# Altium project SMAQ-Board_Design.PrjPcb (part 3 of 3)

## Sheet [6] - A2 Full Schematic.SchDoc: SMAQ Board Full Schematic
size A2; ApprovedBy: Team 7; CheckedBy: Charitonidis A.; Author: Charitonidis Alexandros; CompanyName: SMAQ; DrawnBy: Charitonidis A.; Engineer: Charitonidis Alexandros; DocumentNumber: SCH-A2; Revision: 1.1; SheetNumber: 6; SheetTotal: 6; =documentnumber: 1
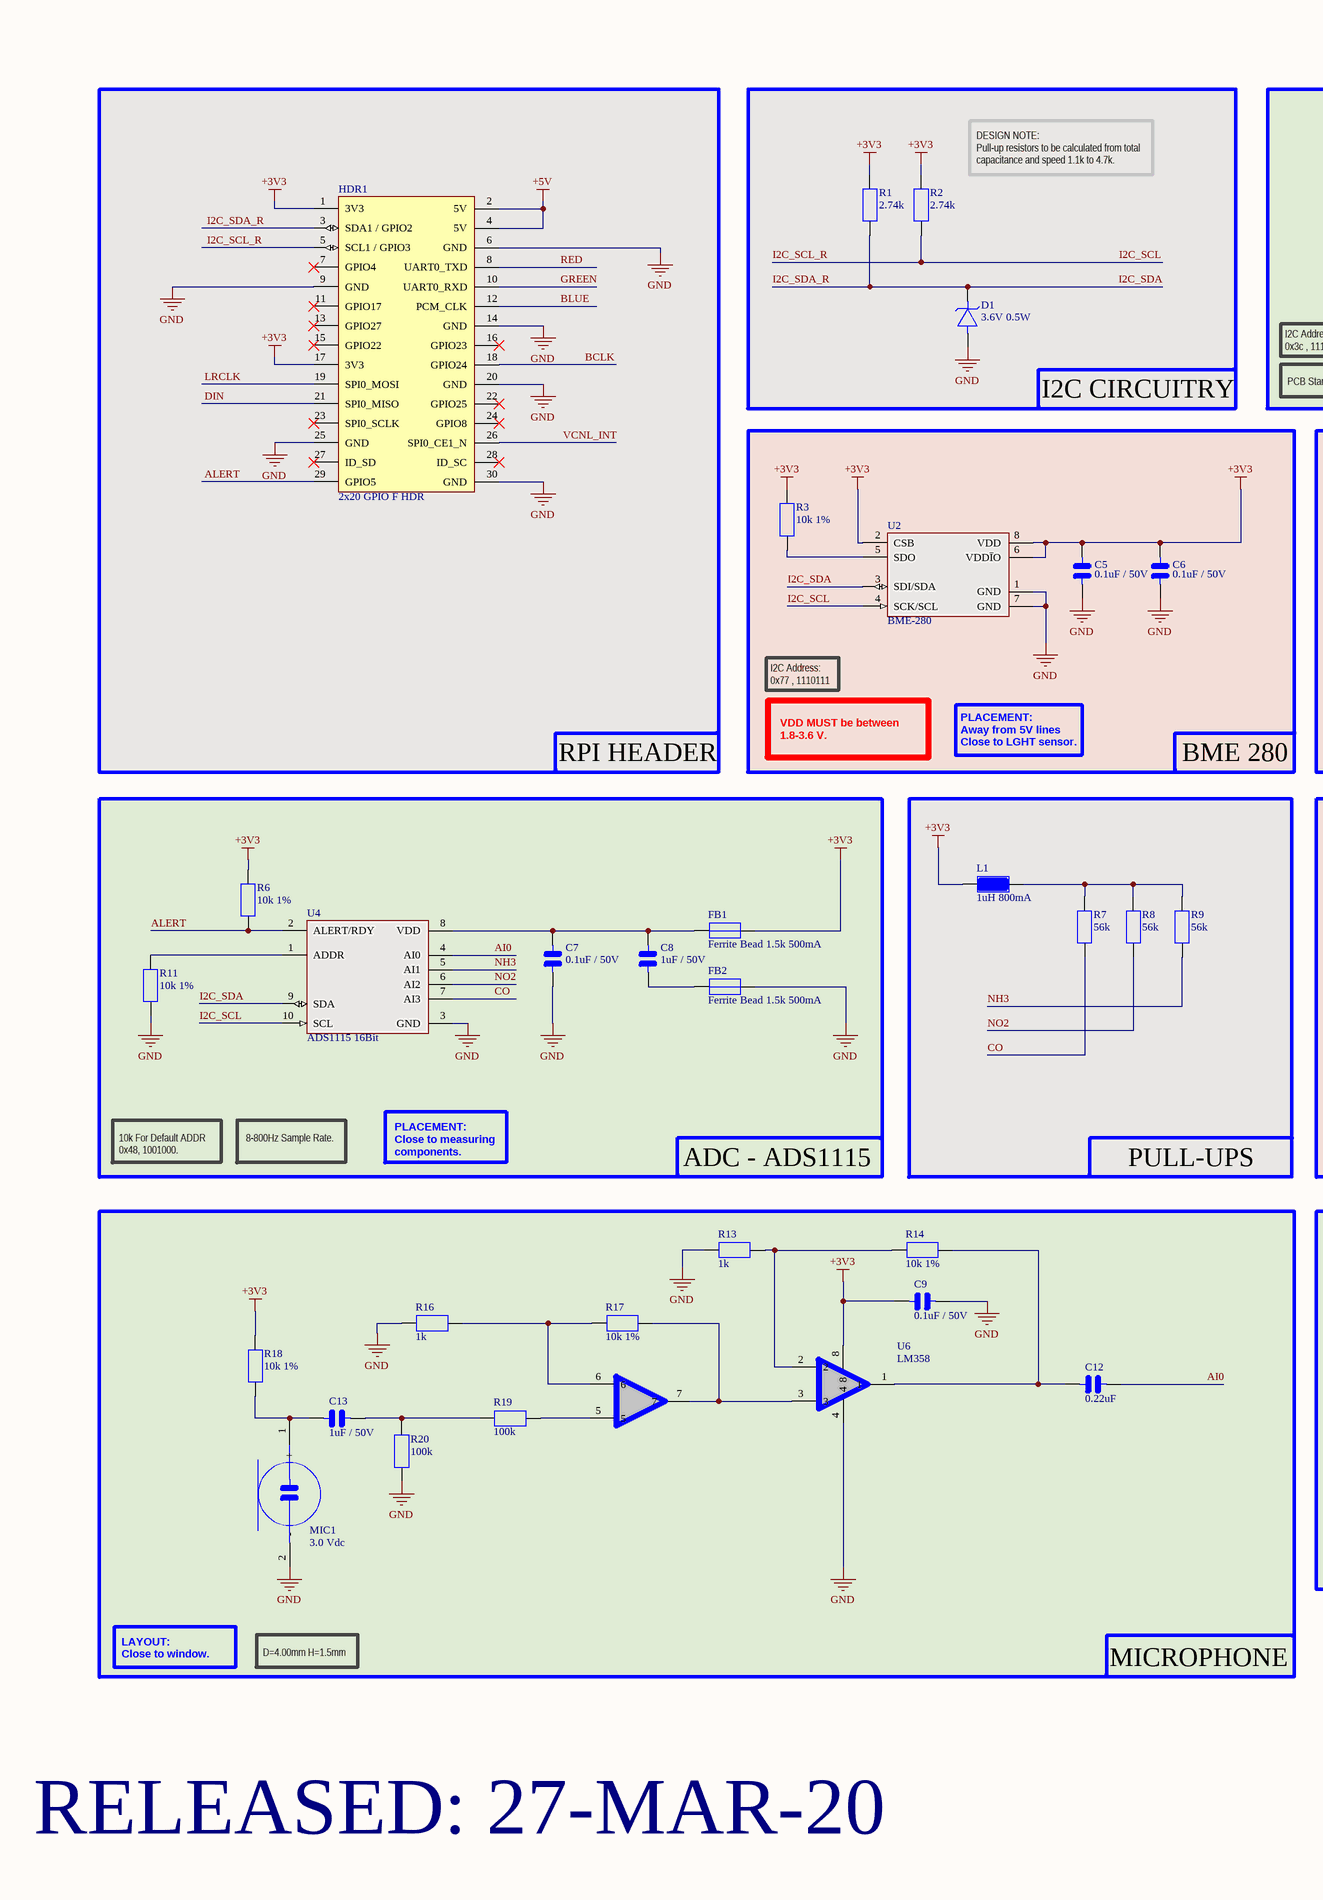
[diagram p5: [6] - A2 Full Schematic.SchDoc, left]
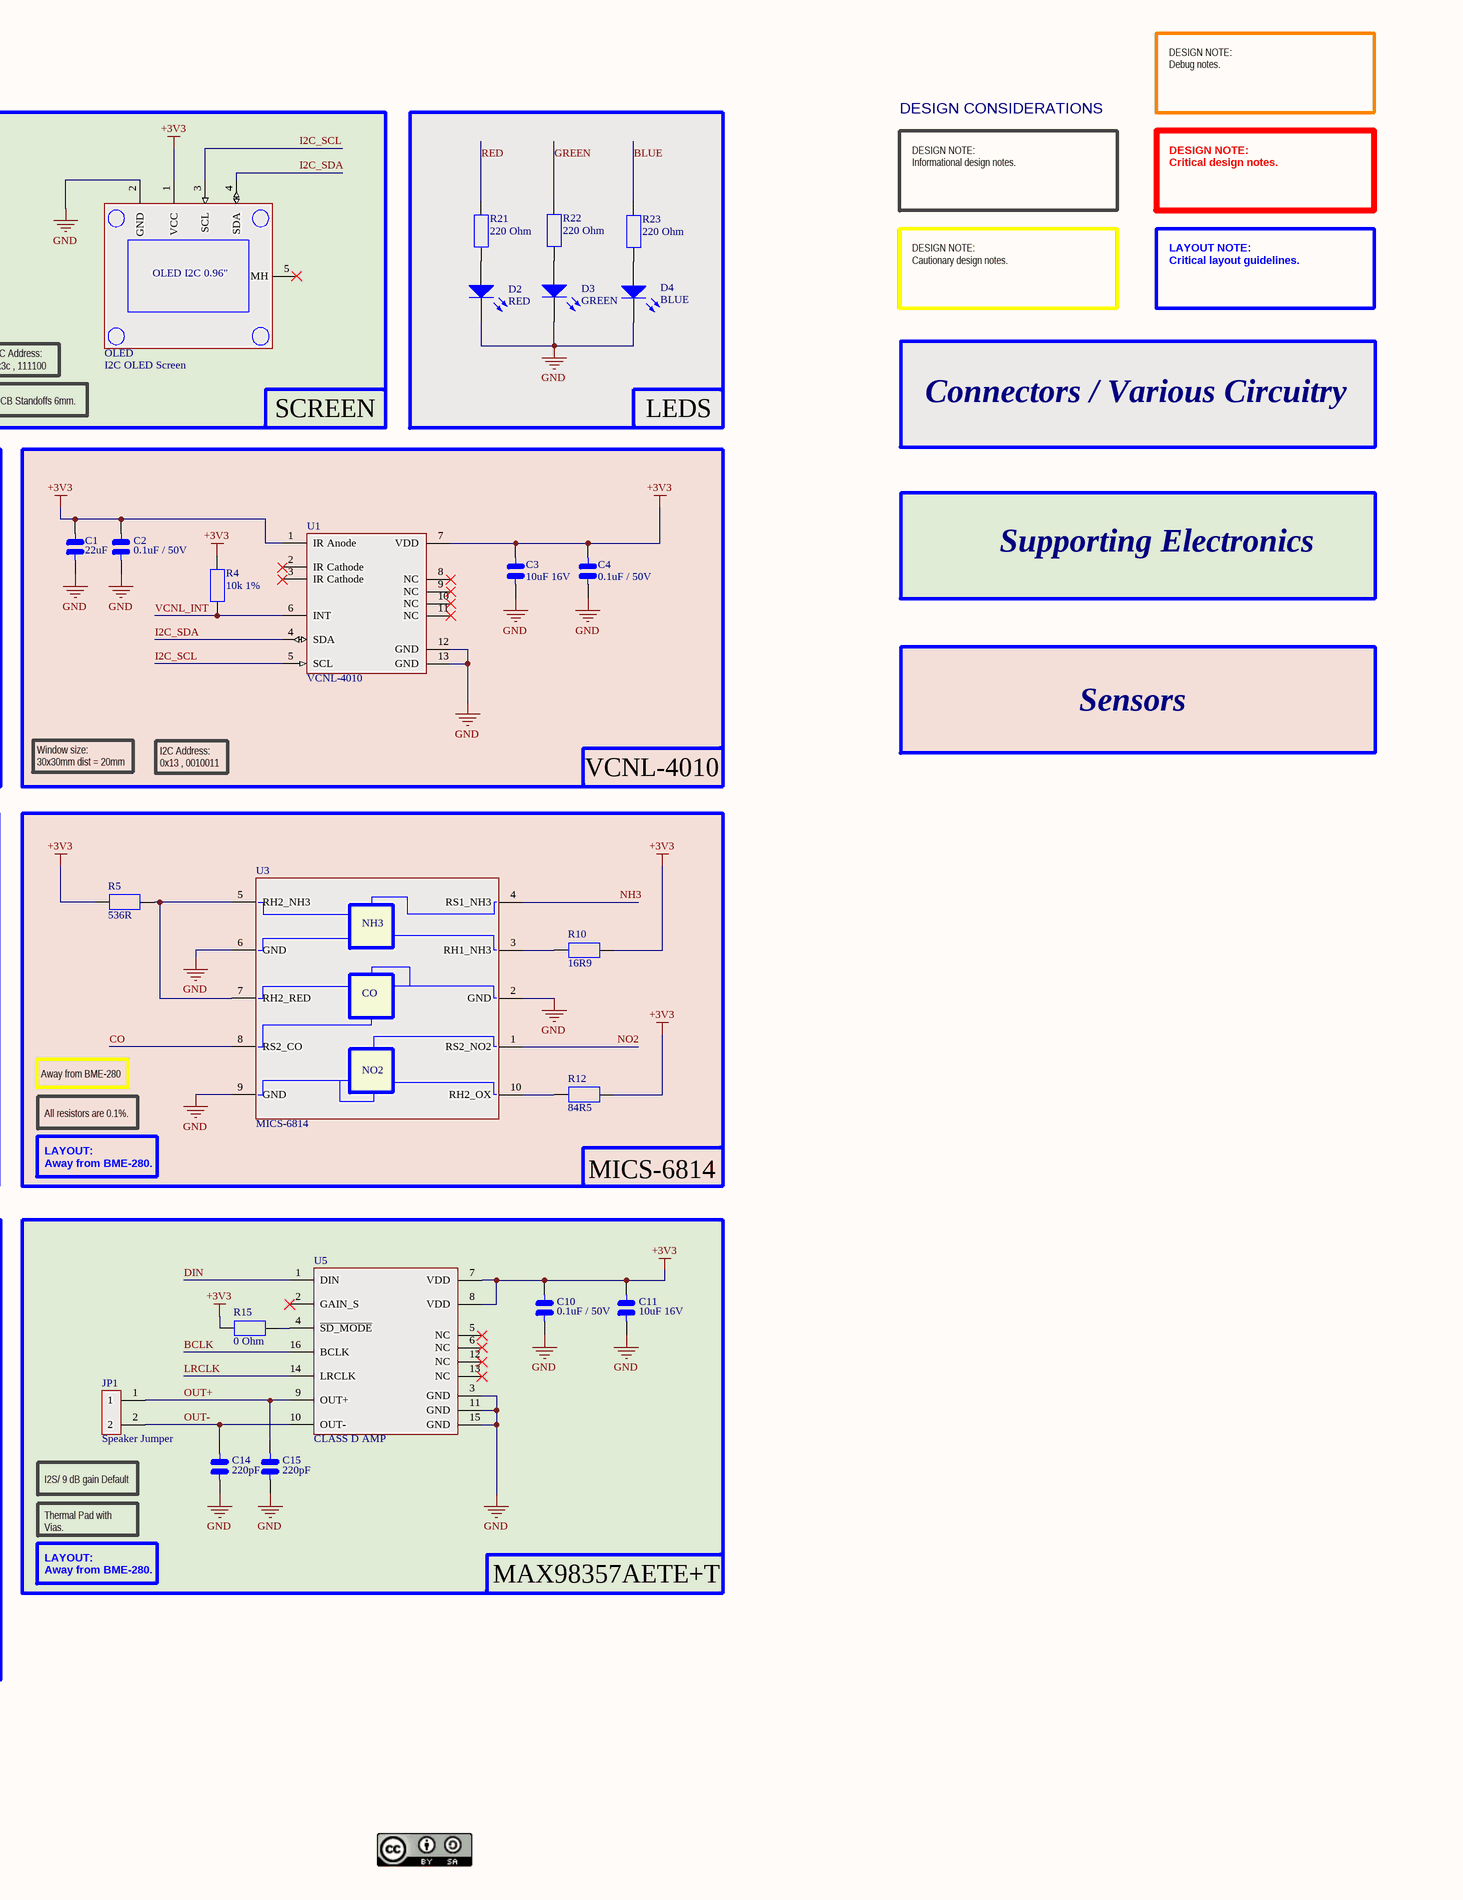
[diagram p6: [6] - A2 Full Schematic.SchDoc, right]

### Parts
(Parts that share a designator on the sheet are numbered #1, #2 ... from top to bottom, then left to right.)
C1#2  22uF  [C0805]
C2#2  0.1uF / 50V  [C0805]
C3#2  10uF 16V  [C0805]
C4#2  0.1uF / 50V  [C0805]
C5#2  0.1uF / 50V  [C0805]
C6#2  0.1uF / 50V  [C0805]
C7#2  0.1uF / 50V  [C0805]
C8#2  1uF / 50V  [C0805]
C9#2  0.1uF / 50V  [C0805]
C10#2  0.1uF / 50V  [C0805]
C11#2  10uF 16V  [C0805]
C12#2  0.22uF  [C0805]
C13#2  1uF / 50V  [C0805]
C14#2  220pF  [C0805]
C15#2  220pF  [C0805]
D1#2  3.6V 0.5W  [SOD-123]
D2#2  RED  [LED-1]
D3#2  GREEN  [LED-1]
D4#2  BLUE  [LED-1]
FB1#2  Ferrite Bead 1.5k 500mA  [C0805]
FB2#2  Ferrite Bead 1.5k 500mA  [C0805]
HDR1  2x20 GPIO F HDR  [2x20_Pi_Header]
JP1#2  Speaker Jumper  [Speaker Jumper]
L1#2  1uH 800mA  [C0805]
MIC1#2  3.0 Vdc  [Speaker Jumper]
OLED#2  I2C OLED Screen  [OLED_I2C_0.96"]  (no BOM)
R1#2  2.74k  [R0805 (2012M)]
R2#2  2.74k  [R0805 (2012M)]
R3#2  10k 1%  [R0805 (2012M)]
R4#2  10k 1%  [R0805 (2012M)]
R5#2  536R  [R0805 (2012M)]
R6#2  10k 1%  [R0805 (2012M)]
R7#2  56k  [R0805 (2012M)]
R8#2  56k  [R0805 (2012M)]
R9#2  56k  [R0805 (2012M)]
R10#2  16R9  [R0805 (2012M)]
R11#2  10k 1%  [R0805 (2012M)]
R12#2  84R5  [R0805 (2012M)]
R13#2  1k  [R0805 (2012M)]
R14#2  10k 1%  [R0805 (2012M)]
R15#2  0 Ohm  [R0805 (2012M)]
R16#2  1k  [R0805 (2012M)]
R17#2  10k 1%  [R0805 (2012M)]
R18#2  10k 1%  [R0805 (2012M)]
R19#2  100k  [R0805 (2012M)]
R20#2  100k  [R0805 (2012M)]
R21#2  220 Ohm  [R0805 (2012M)]
R22#2  220 Ohm  [R0805 (2012M)]
R23#2  220 Ohm  [R0805 (2012M)]
U1#2  VCNL-4010  [VCNL-4010]
U2#2  BME-280  [LGA_8P_0.65MM]
U3#2  MICS-6814  [MICS-10]
U4#2  ADS1115 16Bit  [VSSOP-10]
U5  CLASS D AMP  [16LTHINQFN]
U6#2  LM358  [SOIC-8]

### Blocks framed on the sheet
RPI HEADER: HDR1
I2C CIRCUITRY: D1#2 R1#2 R2#2
SCREEN: OLED#2
LEDS: D2#2 D3#2 D4#2 R21#2 R22#2 R23#2
BME 280: C5#2 C6#2 R3#2 U2#2
VCNL-4010: C1#2 C2#2 C3#2 C4#2 R4#2 U1#2
ADC - ADS1115: C7#2 C8#2 FB1#2 FB2#2 R6#2 R11#2 U4#2
PULL-UPS: L1#2 R7#2 R8#2 R9#2
MICS-6814: R5#2 R10#2 R12#2 U3#2
MICROPHONE: C9#2 C12#2 C13#2 MIC1#2 R13#2 R14#2 R16#2 R17#2 R18#2 R19#2 R20#2 U6#2
MAX98357AETE+T: C10#2 C11#2 C14#2 C15#2 JP1#2 R15#2 U5

### Nets
+3V3: C1#2.2 C2#2.2 C3#2.2 C4#2.1 C5#2.2 C6#2.2 C9#2.1 C10#2.2 C11#2.2 FB1#2.2 HDR1.1(3V3) HDR1.17(3V3) L1#2.1 OLED#2.1(VCC) R1#2.2 R2#2.2 R3#2.2 R4#2.2 R5#2.1 R6#2.2 R10#2.2 R12#2.2 R15#2.2 R18#2.2 U1#2.1(IR_Anode) U1#2.7(VDD) U2#2.2(CSB) U2#2.6(VDD~{I}O) U2#2.8(VDD) U5.7(VDD) U5.8(VDD) U6#2.8
+5V: HDR1.2(5V) HDR1.4(5V)
GND: C1#2.1 C2#2.1 C3#2.1 C4#2.2 C5#2.1 C6#2.1 C7#2.1 C9#2.2 C10#2.1 C11#2.1 C14#2.1 C15#2.1 D1#2.1 D2#2.2(K) D3#2.2(K) D4#2.2(K) FB2#2.2 HDR1.6(GND) HDR1.9(GND) HDR1.14(GND) HDR1.20(GND) HDR1.25(GND) HDR1.30(GND) MIC1#2.2(-) OLED#2.2(GND) R11#2.1 R13#2.1 R16#2.1 R20#2.1 U1#2.12(GND) U1#2.13(GND) U2#2.1(GND) U2#2.7(GND) U3#2.2(GND) U3#2.6(GND) U3#2.9(GND) U4#2.3(GND) U5.3(GND) U5.11(GND) U5.15(GND) U6#2.4
AI0: C12#2.2 U4#2.4(AI0)
ALERT: HDR1.29(GPIO5) R6#2.1 U4#2.2(ALERT/RDY)
BCLK: HDR1.18(GPIO24) U5.16(BCLK)
BLUE: HDR1.12(PCM_CLK) R23#2.2
CO: R7#2.1 U3#2.8(RS2_CO) U4#2.7(AI3)
DIN: HDR1.21(SPI0_MISO) U5.1(DIN)
GREEN: HDR1.10(UART0_RXD) R22#2.2
I2C_SCL: HDR1.5(SCL1_/_GPIO3) OLED#2.3(SCL) R2#2.1 U1#2.5(SCL) U2#2.4(SCK/SCL) U4#2.10(SCL)  [also labelled I2C_SCL_R]
I2C_SDA: D1#2.2 HDR1.3(SDA1_/_GPIO2) OLED#2.4(SDA) R1#2.1 U1#2.4(SDA) U2#2.3(SDI/SDA) U4#2.9(SDA)  [also labelled I2C_SDA_R]
LRCLK: HDR1.19(SPI0_MOSI) U5.14(LRCLK)
NH3: R9#2.1 U3#2.4(RS1_NH3) U4#2.5(AI1)
NO2: R8#2.1 U3#2.1(RS2_NO2) U4#2.6(AI2)
OUT+: C15#2.2 JP1#2.1 U5.9(OUT+)
OUT-: C14#2.2 JP1#2.2 U5.10(OUT-)
RED: HDR1.8(UART0_TXD) R21#2.2
VCNL_INT: HDR1.26(SPI0_CE1_N) R4#2.1 U1#2.6(INT)
NetC7#2_2: C7#2.2 C8#2.2 FB1#2.1 U4#2.8(VDD)
NetC8#2_1: C8#2.1 FB2#2.1
NetC12#2_1: C12#2.1 R14#2.2 U6#2.1
NetC13#2_1: C13#2.1 MIC1#2.1(+) R18#2.1
NetC13#2_2: C13#2.2 R19#2.2 R20#2.2
NetD2#2_1: D2#2.1(A) R21#2.1
NetD3#2_1: D3#2.1(A) R22#2.1
NetD4#2_1: D4#2.1(A) R23#2.1
NetL1#2_2: L1#2.2 R7#2.2 R8#2.2 R9#2.2
NetR3#2_1: R3#2.1 U2#2.5(SDO)
NetR5#2_2: R5#2.2 U3#2.5(RH2_NH3) U3#2.7(RH2_RED)
NetR10#2_1: R10#2.1 U3#2.3(RH1_NH3)
NetR11#2_2: R11#2.2 U4#2.1(ADDR)
NetR12#2_1: R12#2.1 U3#2.10(RH2_OX)
NetR13#2_2: R13#2.2 R14#2.1 U6#2.2
NetR15#2_1: R15#2.1 U5.4(~{SD_MODE})
NetR16#2_2: R16#2.2 R17#2.2 U6#2.6
NetR17#2_1: R17#2.1 U6#2.3 U6#2.7
NetR19#2_1: R19#2.1 U6#2.5

Not connected (* = marked no-connect by the designer): HDR1 7(GPIO4)* 11(GPIO17)* 13(GPIO27)* 15(GPIO22)* 16(GPIO23)* 22(GPIO25)* 23(SPI0_SCLK)* 24(GPIO8)* 27(ID_SD)* 28(ID_SC)*; OLED#2 5(MH)*; U1#2 2(IR_Cathode)* 3(IR_Cathode)* 8(NC)* 9(NC)* 10(NC)* 11(NC)*; U5 2(GAIN_S)* 5(NC)* 6(NC)* 12(NC)* 13(NC)*

### Notes on the sheet
- DESIGN CONSIDERATIONS
- DESIGN NOTE:
  Debug notes.
- DESIGN NOTE:
  Pull-up resistors to be calculated from total capacitance and speed 1.1k to 4.7k.
- DESIGN NOTE:
  Informational design notes.
- DESIGN NOTE:
  Critical design notes.
- DESIGN NOTE:
  Cautionary design notes.
- LAYOUT NOTE:
  Critical layout guidelines.
- I2C Address: 0x3c , 111100
- PCB Standoffs 6mm.
- Connectors / Various Circuitry
- Supporting Electronics
- I2C Address: 0x77 , 1110111
- VDD MUST be between 1.8-3.6 V.
- PLACEMENT:
  Away from 5V lines
  Close to LGHT sensor.
- Window size: 30x30mm dist = 20mm
- I2C Address: 0x13 , 0010011
- Sensors
- Away from BME-280
- All resistors are 0.1%.
- 10k For Default ADDR
  0x48, 1001000.
- 8-800Hz Sample Rate.
- PLACEMENT:
  Close to measuring components.
- LAYOUT:
  Away from BME-280.
- (near JP1#2) I2S/ 9 dB gain Default
- Thermal Pad with Vias.
- LAYOUT:
  Close to window.
- D=4.00mm H=1.5mm
- RELEASED: 27-MAR-20
- Title
- Drawn By:
- Checked By:
- Size:
- Date:
- A2
- Number:
- Time:
- Revision:
- Sheet
- of
- Approved By:
- Team Number:
- This work is licensed under the Creative Commons Attribution-ShareAlike 3.0 Unported License. To view a copy of this license, visit http://creativecommons.org/licenses/by-sa/3.0/ or send a letter to Creative Commons, PO Box 1866, Mountain View, CA 94042, USA.
- (in symbol MICS-6814) NH3; CO; NO2
- (in symbol OLED_I2C_BREAKOUT) OLED I2C 0.96"

### Library data of the parts
C1#2 = C2012JB1A226M085AC: CAP CER 22UF 10V JB 0805; Manufacturer 1: TDK; Category 1: Ceramic Capacitors; Dielectric Material: Ceramic; Tolerance: 20%; Supplier 1: Mouser; Manufacturer Part Number 1: C2012JB1A226M085AC; RoHS: Yes; Description 1: CAP CER 22UF 10V JB 0805; Stock 1: 10381; Mount: Surface Mount; Case/Package: 0805; Case Code (Metric): 2012; Case Code (Imperial): 0805; Min Operating Temperature: -25°C; Max Operating Temperature: 85°C; Package Quantity: 1; Packaging: Tape and Reel; Capacitance: 22uF; Voltage Rating: 10V; Termination: SMD/SMT; Composition: Ceramic; Voltage Rating (DC): 10V; Length: 0.079inch; Height: 0.85mm; Width: 1.2mm; Thickness: 0.039inch; Lead Free: Lead Free; ComponentLink1URL: https://datasheet.ciiva.com/14908/tdkmlcccaprange-14908199.pdf?src-supplier=Digi-Key; ComponentLink1Description: https://datasheet.ciiva.com/14908/tdkmlcccaprange-14908199.pdf?src-supplier=Digi-Key; ComponentLink2URL: https://datasheet.ciiva.com/14908/tdkmlcccaprange-14908201.pdf?src-supplier=Digi-Key; ComponentLink2Description: https://datasheet.ciiva.com/14908/tdkmlcccaprange-14908201.pdf?src-supplier=Digi-Key; Supplier Part Number 1: 810-C2012JB1A226M08C
C2#2 C4#2 C5#2 C6#2 C7#2 C9#2 C10#2 = 08055C104JAT4A: CAP CER 0.1UF 50V X7R 0805; Manufacturer 1: Kyocera AVX; Category 1: Ceramic Capacitors; Capacitance: 100nF; Tolerance: 5%; Supplier 1: Mouser; Manufacturer Part Number 1: 08055C104JAT4A; RoHS: Yes; Description 1: CAP CER 0.1UF 50V X7R 0805; Stock 1: 70357; Mount: Surface Mount; Case/Package: 0805; Number of Pins: 2; Case Code (Imperial): 0805; Case Code (Metric): 2012; Min Operating Temperature: -55°C; Max Operating Temperature: 125°C; Dielectric: X7R; Package Quantity: 10000; Voltage Rating: 50V; Packaging: Tape and Reel; Termination: SMD/SMT; Voltage Rating (DC): 50V; Length: 2.01mm; Depth: 1.25mm; Width: 0.049inch; Thickness: 0.037inch; Radiation Hardening: No; Lead Free: Lead Free; ComponentLink1URL: https://datasheet.ciiva.com/16326/cx7r-16326437.pdf?src-supplier=Future+Electronics; ComponentLink1Description: https://datasheet.ciiva.com/16326/cx7r-16326437.pdf?src-supplier=Future+Electronics; ComponentLink2URL: https://datasheet.ciiva.com/6277/cx7r-6277722.pdf?src-supplier=Digi-Key; ComponentLink2Description: https://datasheet.ciiva.com/6277/cx7r-6277722.pdf?src-supplier=Digi-Key; Supplier Part Number 1: 581-08055C104JAT4A
C3#2 C11#2 = 0805YC106MAT2A: Manufacturer 1: Kyocera AVX; Supplier 1: Mouser; Manufacturer Part Number 1: 0805YC106MAT2A; RoHS: No; Stock 1: 1756; Supplier Part Number 1: 581-0805YC106MAT2A
C8#2 C13#2 = 08055C105JAT2A: Manufacturer 1: Kyocera AVX; Category 1: Capacitors; Dielectric: X7R; Tolerance: 5%; Supplier 1: Mouser; Manufacturer Part Number 1: 08055C105JAT2A; RoHS: No; Stock 1: 5621; Voltage: 50V; Supplier Part Number 1: 581-08055C105JAT2A
C12#2 = 08053C224J4Z2A: Multilayer Ceramic Capacitors MLCC - SMD/SMT 25V 0.22uF X7R 0805 5% AEC-Q200; Manufacturer 1: Kyocera AVX; Supplier 1: Mouser; Manufacturer Part Number 1: 08053C224J4Z2A; RoHS: No; Stock 1: 37375; Supplier Part Number 1: 581-08053C224J4Z2A
C14#2 C15#2 = 08055A221F4T2A: T&R / COMMERCIAL CHIP; Manufacturer 1: Kyocera AVX; Category 1: Ceramic Capacitors; Dielectric: C0G; Voltage Rating (DC): 50V; Tolerance: 1%; Supplier 1: Mouser; Manufacturer Part Number 1: 08055A221F4T2A; RoHS: No; Description 1: T&R / COMMERCIAL CHIP; Stock 1: 6955; Case/Package: 0805; Capacitance: 220pF; Supplier Part Number 1: 581-08055A221F4T2A
D1#2 = BZT52B3V6-E3-08: Diode Zener Single 3.6V 2% 500mW 2-Pin SOD-123 T/R; Manufacturer 1: Vishay; Category 1: Zener Diodes; Max Power Dissipation: 410mW; Impedance: 80R; Zener Current: 100mA; Max Reverse Leakage Current: 100nA; Supplier 1: Mouser; Manufacturer Part Number 1: BZT52B3V6-E3-08; RoHS: Yes; Description 1: Diode Zener Single 3.6V 2% 500mW 2-Pin SOD-123 T/R; Stock 1: 29413; Mount: Surface Mount; Case/Package: SOD-123-2; Number of Pins: 2; Weight: 0.000363oz; Min Operating Temperature: -55°C; Max Operating Temperature: 150°C; Packaging: Tape and Reel; Package Quantity: 3000; Zener Voltage: 3.6V; Voltage Tolerance: 2%; Power Dissipation: 500mW; Element Configuration: Single; Tolerance: 2%; ComponentLink1URL: https://datasheet.ciiva.com/24095/bzt52-106265-24095710.pdf?src-supplier=Mouser; ComponentLink1Description: https://datasheet.ciiva.com/24095/bzt52-106265-24095710.pdf?src-supplier=Mouser; Supplier Part Number 1: 78-BZT52B3V6-E3-08
D2#2 D3#2 D4#2 = LED1: Typical RED GaAs LED; Published: 8-Jun-2000; LatestRevisionDate: 08-Jul-2005; LatestRevisionNote: Mech Layer 1 removed.; PackageReference: LED-1; Publisher: Altium Limited; PackageDescription: LED; 2 Leads
FB1#2 FB2#2 = MMZ2012Y152B: Ferrite Beads Multi-Layer 1.5KOhm 25% 100MHz 500mA 400mOhm DCR 0805; Manufacturer 1: TDK; Category 1: Inductors; Impedance: 1.5kR; DC Resistance (DCR): 400mR; Shielding: Unshielded; Supplier 1: Farnell; Manufacturer Part Number 1: MMZ2012Y152B; RoHS: Yes; Description 1: Ferrite Beads Multi-Layer 1.5KOhm 25% 100MHz 500mA 400mOhm DCR 0805; Pricing 1: 10=0.05740, 100=0.03680, 500=0.02670, 1000=0.02100, 2000=0.01900, 4000=0.01700, 20000=0.01600 (GBP); Case/Package: 0805; Number of Pins: 2; Case Code (Metric): 2012; Case Code (Imperial): 0805; Core Material: Ferrite; Material: Ferrite; Min Operating Temperature: -55°C; Max Operating Temperature: 125°C; Tolerance: 25%; Packaging: Tape and Reel; Package Quantity: 4000; Max DC Current: 500mA; Termination: SMD/SMT; Current Rating: 500mA; Test Frequency: 100MHz; DC Current: 500mA; Military Standard: Not; Frequency: 100MHz; Length: 2mm; Height: 0.85mm; Width: 1.25mm; Depth: 1.25mm; Radiation Hardening: No; REACH SVHC: No SVHC; Lead Free: Lead Free; ComponentLink1URL: https://datasheet.ciiva.com/11800/0900766b8082f891-11800917.pdf?src-supplier=RSComponents; ComponentLink1Description: https://datasheet.ciiva.com/11800/0900766b8082f891-11800917.pdf?src-supplier=RSComponents; ComponentLink2URL: https://datasheet.ciiva.com/34302/1868995-34302918.pdf?src-supplier=Jameco; ComponentLink2Description: https://datasheet.ciiva.com/34302/1868995-34302918.pdf?src-supplier=Jameco; ComponentLink3URL: https://datasheet.ciiva.com/15160/getdatasheetpartid-77343-15160260.pdf?src-supplier=Verical; ComponentLink3Description: https://datasheet.ciiva.com/15160/getdatasheetpartid-77343-15160260.pdf?src-supplier=Verical; ComponentLink4URL: https://datasheet.ciiva.com/16001/e9412-mmz2012-16001336.pdf?src-supplier=Onlinecomponents.com; ComponentLink4Description: https://datasheet.ciiva.com/16001/e9412-mmz2012-16001336.pdf?src-supplier=Onlinecomponents.com; Supplier Part Number 1: 1301674
HDR1 = 2X20 Female Header: GPIO FEMALE HEADER RASPBERRY PI; Manufacturer 1: Adafruit Industries; Manufacturer Part Number 1: 2222; Supplier 1: Mouser; RoHS: No; Description 1: GPIO FEMALE HEADER RASPBERRY PI; Stock 1: 1767; ComponentLink1URL: https://cdn-shop.adafruit.com/product-files/2222/00587.pdf?src-supplier=Digi-Key; ComponentLink1Description: https://cdn-shop.adafruit.com/product-files/2222/00587.pdf?src-supplier=Digi-Key; Supplier Part Number 1: 485-2222
L1#2 = KLZ2012MHR1R0HTD25: FIXED IND 1UH 800MA 130 MOHM SMD; Manufacturer 1: TDK; Supplier 1: Mouser; Manufacturer Part Number 1: KLZ2012MHR1R0HTD25; RoHS: No; Description 1: FIXED IND 1UH 800MA 130 MOHM SMD; Stock 1: 3633; ComponentLink1URL: https://product.tdk.com/info/en/catalog/datasheets/inductor_automotive_decoupling_klz2012-hr_en.pdf?src-supplier=Digi-Key; ComponentLink1Description: https://product.tdk.com/info/en/catalog/datasheets/inductor_automotive_decoupling_klz2012-hr_en.pdf?src-supplier=Digi-Key; Supplier Part Number 1: 810-KLZ2012MHR1R0HTD
MIC1#2 = CMC-4015-25L100: 4.0 mm, Omnidirectional, Wire Leads, 3.0 Vdc, IP65 Rated, Electret Condenser Microphone; Manufacturer 1: CUI Devices; Supplier 1: Mouser; Manufacturer Part Number 1: CMC-4015-25L100; Description 1: 4.0 mm, Omnidirectional, Wire Leads, 3.0 Vdc, IP65 Rated, Electret Condenser Microphone; Stock 1: 486; ComponentLink1URL: http://datasheet.octopart.com/CMC-4015-25L100-CUI-Devices-datasheet-137937391.pdf?src-supplier=CUI+Devices; ComponentLink1Description: http://datasheet.octopart.com/CMC-4015-25L100-CUI-Devices-datasheet-137937391.pdf?src-supplier=CUI+Devices; Supplier Part Number 1: 490-CMC-4015-25L100
OLED#2 = OLED_I2C_BREAKOUT
R1#2 R2#2 = ERA-6AEB2741V: Surface Mount Chip Resistor, Thin Film, AEC-Q200 ERA Series, 2.74 kohm, 125 mW, 0.1%, 100 V; Manufacturer 1: Panasonic; Category 1: Chip SMD Resistors; Resistance: 2.74kR; Temperature Coefficient: 25ppm/°C; Power Rating: 125mW; Voltage Rating: 100V; Supplier 1: Farnell; Manufacturer Part Number 1: ERA-6AEB2741V; RoHS: Yes; Description 1: Surface Mount Chip Resistor, Thin Film, AEC-Q200 ERA Series, 2.74 kohm, 125 mW, 0.1%, 100 V; Stock 1: 20000; Pricing 1: 5000=0.02100 (GBP); Mount: Surface Mount; Case/Package: 0805; Number of Pins: 2; Contact Plating: Tin; Case Code (Imperial): 0805; Case Code (Metric): 2012; Min Operating Temperature: -55°C; Max Operating Temperature: 155°C; Tolerance: 0.1%; Composition: Metal Film,Thin Film; Packaging: Tape and Reel; Package Quantity: 1; Number of Terminations: 2; Military Standard: Not; Termination: Solder; Max Power Dissipation: 125mW; Voltage Rating (DC): 100V; Features: Automotive AEC-Q200; Length: 2mm; Height: 0.5mm; Width: 1.25mm; Depth: 1.25mm; Radiation Hardening: No; Lead Free: Lead Free; ComponentLink1URL: https://datasheet.ciiva.com/11812/0900766b80eb1d8c-11812023.pdf?src-supplier=RSComponents; ComponentLink1Description: https://datasheet.ciiva.com/11812/0900766b80eb1d8c-11812023.pdf?src-supplier=RSComponents; ComponentLink2URL: https://datasheet.ciiva.com/41450/001181270-da-01-en-widerstand-era-0805-2k74-0-1-5000st-41450431.pdf?src-supplier=Conrad; ComponentLink2Description: https://datasheet.ciiva.com/41450/001181270-da-01-en-widerstand-era-0805-2k74-0-1-5000st-41450431.pdf?src-supplier=Conrad; ComponentLink3URL: https://datasheet.ciiva.com/24025/aoa0000ce26-197354-24025606.pdf?src-supplier=Mouser; ComponentLink3Description: https://datasheet.ciiva.com/24025/aoa0000ce26-197354-24025606.pdf?src-supplier=Mouser; ComponentLink4URL: https://datasheet.ciiva.com/7763/485442-7763559.pdf?src-supplier=Element14; ComponentLink4Description: https://datasheet.ciiva.com/7763/485442-7763559.pdf?src-supplier=Element14; ComponentLink5URL: https://datasheet.ciiva.com/7763/485442-7763560.pdf?src-supplier=Element14; ComponentLink5Description: https://datasheet.ciiva.com/7763/485442-7763560.pdf?src-supplier=Element14; ComponentLink6URL: https://datasheet.ciiva.com/6129/485442-6129482.pdf?src-supplier=Farnell; ComponentLink6Description: https://datasheet.ciiva.com/6129/485442-6129482.pdf?src-supplier=Farnell; ComponentLink7URL: https://datasheet.ciiva.com/6129/485442-6129483.pdf?src-supplier=Farnell; ComponentLink7Description: https://datasheet.ciiva.com/6129/485442-6129483.pdf?src-supplier=Farnell; ComponentLink8URL: https://datasheet.ciiva.com/6129/485442-6129478.pdf?src-supplier=Farnell; ComponentLink8Description: https://datasheet.ciiva.com/6129/485442-6129478.pdf?src-supplier=Farnell; ComponentLink9URL: https://datasheet.ciiva.com/9196/aoa0000ce26-9196845.pdf?src-supplier=Avnet; ComponentLink9Description: https://datasheet.ciiva.com/9196/aoa0000ce26-9196845.pdf?src-supplier=Avnet; Supplier Part Number 1: 1810978
R3#2 R4#2 R6#2 R11#2 R14#2 R17#2 R18#2 = AT0805FRE0710KL: RES SMD 10K OHM 1% 1/8W 0805; Manufacturer 1: Yageo; Category 1: Chip SMD Resistors; Resistance: 10kR; Max Power Dissipation: 125mW; Temperature Coefficient: 50ppm/°C; Supplier 1: Mouser; Manufacturer Part Number 1: AT0805FRE0710KL; RoHS: Yes; Description 1: RES SMD 10K OHM 1% 1/8W 0805; Stock 1: 12821; Case/Package: 0805; Case Code (Metric): 2012; Case Code (Imperial): 0805; Min Operating Temperature: -55°C; Max Operating Temperature: 155°C; Packaging: Tape and Reel; Composition: Thin Film; Number of Terminations: 2; Tolerance: 1%; Features: Moisture Resistant,Automotive AEC-Q200,Anti-Sulfur; Length: 0.079inch; Height: 0.024inch; Width: 0.049inch; ComponentLink1URL: http://www.yageo.com/documents/recent/PYu-AT_51_RoHS_L_5.pdf?src-supplier=Digi-Key; ComponentLink1Description: http://www.yageo.com/documents/recent/PYu-AT_51_RoHS_L_5.pdf?src-supplier=Digi-Key; ComponentLink2URL: http://www.yageo.com/documents/recent/PYu-AT_51_RoHS_L-3.pdf?src-supplier=Digi-Key; ComponentLink2Description: http://www.yageo.com/documents/recent/PYu-AT_51_RoHS_L-3.pdf?src-supplier=Digi-Key; Supplier Part Number 1: 603-AT0805FRE0710KL
R5#2 = ERA6AEB5360V: RES SMD 536 OHM 0.1% 1/8W 0805; Manufacturer 1: Panasonic; Category 1: Chip SMD Resistors; Power Rating: 125mW; Voltage Rating: 100V; Temperature Coefficient: 25ppm/°C; Supplier 1: Mouser; Manufacturer Part Number 1: ERA6AEB5360V; RoHS: Yes; Description 1: RES SMD 536 OHM 0.1% 1/8W 0805; Stock 1: 8172; Mount: Surface Mount; Case/Package: 0805; Number of Pins: 2; Case Code (Metric): 2012; Case Code (Imperial): 0805; Contact Plating: Tin; Min Operating Temperature: -55°C; Max Operating Temperature: 155°C; Tolerance: 0.1%; Packaging: Tape and Reel; Resistance: 536R; Package Quantity: 1; Composition: Thin Film,Metal Film; Number of Terminations: 2; Termination: SMD/SMT; Military Standard: Not; Max Power Dissipation: 125mW; Voltage Rating (DC): 100V; Features: Automotive AEC-Q200; Length: 2mm; Height: 0.5mm; Width: 1.25mm; Depth: 1.25mm; Radiation Hardening: No; REACH SVHC: No SVHC; Lead Free: Lead Free; ComponentLink1URL: https://datasheet.ciiva.com/11810/0900766b80eb1d8c-11810459.pdf?src-supplier=RSComponents; ComponentLink1Description: https://datasheet.ciiva.com/11810/0900766b80eb1d8c-11810459.pdf?src-supplier=RSComponents; ComponentLink2URL: https://datasheet.ciiva.com/41450/001181222-da-01-en-widerstand-era-0805-536r-0-1-5000st-41450380.pdf?src-supplier=Conrad; ComponentLink2Description: https://datasheet.ciiva.com/41450/001181222-da-01-en-widerstand-era-0805-536r-0-1-5000st-41450380.pdf?src-supplier=Conrad; ComponentLink3URL: https://datasheet.ciiva.com/9181/aoa0000ce26-9181246.pdf?src-supplier=Avnet; ComponentLink3Description: https://datasheet.ciiva.com/9181/aoa0000ce26-9181246.pdf?src-supplier=Avnet; Supplier Part Number 1: 667-ERA-6AEB5360V
R7#2 R8#2 R9#2 = ERA-6AEB563V: RES SMD 56K OHM 0.1% 1/8W 0805; Manufacturer 1: Panasonic; Category 1: Chip SMD Resistors; Resistance: 56kR; Temperature Coefficient: 25ppm/°C; Power Rating: 125mW; Voltage Rating: 100V; Supplier 1: Mouser; Manufacturer Part Number 1: ERA-6AEB563V; RoHS: Yes; Description 1: RES SMD 56K OHM 0.1% 1/8W 0805; Stock 1: 14319; Mount: Surface Mount; Case/Package: 0805; Number of Pins: 2; Contact Plating: Tin; Case Code (Metric): 2012; Case Code (Imperial): 0805; Min Operating Temperature: -55°C; Max Operating Temperature: 155°C; Composition: Thin Film; Tolerance: 0.1%; Packaging: Tape and Reel; Package Quantity: 1; Termination: SMD/SMT; Number of Terminations: 2; Military Standard: Not; Max Power Dissipation: 125mW; Voltage Rating (DC): 100V; Features: Automotive AEC-Q200; Length: 2mm; Height: 0.5mm; Width: 1.25mm; Depth: 1.25mm; Radiation Hardening: No; REACH SVHC: No SVHC; Lead Free: Lead Free; ComponentLink1URL: https://datasheet.ciiva.com/11815/0900766b80beefcc-11815835.pdf?src-supplier=RSComponents; ComponentLink1Description: https://datasheet.ciiva.com/11815/0900766b80beefcc-11815835.pdf?src-supplier=RSComponents; ComponentLink2URL: https://datasheet.ciiva.com/26335/453572-da-01-en-widerstand-0805-era-26335719.pdf?src-supplier=Conrad; ComponentLink2Description: https://datasheet.ciiva.com/26335/453572-da-01-en-widerstand-0805-era-26335719.pdf?src-supplier=Conrad; ComponentLink3URL: https://datasheet.ciiva.com/6138/485442-6138597.pdf?src-supplier=Farnell; ComponentLink3Description: https://datasheet.ciiva.com/6138/485442-6138597.pdf?src-supplier=Farnell; ComponentLink4URL: https://datasheet.ciiva.com/48530/era-eng-tds-48530021.pdf?src-supplier=Distrelec; ComponentLink4Description: https://datasheet.ciiva.com/48530/era-eng-tds-48530021.pdf?src-supplier=Distrelec; ComponentLink5URL: https://datasheet.ciiva.com/6138/485442-6138602.pdf?src-supplier=Farnell; ComponentLink5Description: https://datasheet.ciiva.com/6138/485442-6138602.pdf?src-supplier=Farnell; ComponentLink6URL: https://datasheet.ciiva.com/7886/485442-7886650.pdf?src-supplier=Element14; ComponentLink6Description: https://datasheet.ciiva.com/7886/485442-7886650.pdf?src-supplier=Element14; ComponentLink7URL: https://datasheet.ciiva.com/7886/485442-7886651.pdf?src-supplier=Element14; ComponentLink7Description: https://datasheet.ciiva.com/7886/485442-7886651.pdf?src-supplier=Element14; ComponentLink8URL: https://datasheet.ciiva.com/30221/54aoa0000ce26-30221499.pdf?src-supplier=Onlinecomponents.com; ComponentLink8Description: https://datasheet.ciiva.com/30221/54aoa0000ce26-30221499.pdf?src-supplier=Onlinecomponents.com; ComponentLink9URL: https://datasheet.ciiva.com/6138/485442-6138604.pdf?src-supplier=Farnell; ComponentLink9Description: https://datasheet.ciiva.com/6138/485442-6138604.pdf?src-supplier=Farnell; ComponentLink10URL: https://datasheet.ciiva.com/7886/485442-7886652.pdf?src-supplier=Element14; ComponentLink10Description: https://datasheet.ciiva.com/7886/485442-7886652.pdf?src-supplier=Element14; ComponentLink11URL: https://datasheet.ciiva.com/17209/aoa0000ce26-17209230.pdf?src-supplier=Avnet+Europe; ComponentLink11Description: https://datasheet.ciiva.com/17209/aoa0000ce26-17209230.pdf?src-supplier=Avnet+Europe; Supplier Part Number 1: 667-ERA-6AEB563V
R10#2 = ERJ-P06F17R4V: Res Thick Film 0805 16.9 Ohm 1% 1/4W 300ppm/C Molded SMD Punched Carrier T/R; Manufacturer 1: Panasonic; Description 1: Res Thick Film 0805 17.4 Ohm 1% 1/4W 300ppm/C Molded SMD Punched Carrier T/R; Category 1: Chip SMD Resistors; Resistance: 17.4R; Power Rating: 500mW; Voltage Rating: 150V; Temperature Coefficient: 300ppm/°C; Voltage Rating (DC): 400V; Manufacturer Part Number 1: ERJ-P06F17R4V; RoHS: Yes; Mount: Surface Mount; Case/Package: 0805; Case Code (Imperial): 0805; Case Code (Metric): 2012; Min Operating Temperature: -55°C; Max Operating Temperature: 155°C; Tolerance: 1%; Packaging: Tape and Reel; Package Quantity: 5000; Composition: Thick Film; Termination: SMD/SMT; Length: 2mm; Height: 0.6mm; Width: 1.2mm; REACH SVHC: No SVHC; ComponentLink1URL: https://datasheet.ciiva.com/24064/aoa0000ce4-64075-24064442.pdf?src-supplier=Mouser; ComponentLink1Description: https://datasheet.ciiva.com/24064/aoa0000ce4-64075-24064442.pdf?src-supplier=Mouser; ComponentLink2URL: https://datasheet.ciiva.com/22720/1801181-22720492.pdf?src-supplier=Element14; ComponentLink2Description: https://datasheet.ciiva.com/22720/1801181-22720492.pdf?src-supplier=Element14; Supplier 1: Mouser; Supplier Part Number 1: 667-ERJ-P06D17R4V
R12#2 = ERA-6AEB84R5V: RES SMD 84.5 OHM 0.1% 1/8W 0805; Manufacturer 1: Panasonic; Category 1: Chip SMD Resistors; Resistance: 84.5R; Temperature Coefficient: 25ppm/°C; Power Rating: 125mW; Voltage Rating: 100V; Supplier 1: Mouser; Manufacturer Part Number 1: ERA-6AEB84R5V; RoHS: Yes; Description 1: RES SMD 84.5 OHM 0.1% 1/8W 0805; Stock 1: 6145; Mount: Surface Mount; Case/Package: 0805; Number of Pins: 2; Contact Plating: Tin; Case Code (Imperial): 0805; Case Code (Metric): 2012; Min Operating Temperature: -55°C; Max Operating Temperature: 155°C; Tolerance: 0.1%; Composition: Metal Film,Thin Film; Packaging: Tape and Reel; Package Quantity: 1; Termination: SMD/SMT; Number of Terminations: 2; Max Power Dissipation: 125mW; Voltage Rating (DC): 100V; Features: Automotive AEC-Q200; Length: 2mm; Height: 0.5mm; Width: 1.25mm; Depth: 1.25mm; Radiation Hardening: No; Lead Free: Lead Free; ComponentLink1URL: https://datasheet.ciiva.com/11815/0900766b80eb1d8c-11815865.pdf?src-supplier=RSComponents; ComponentLink1Description: https://datasheet.ciiva.com/11815/0900766b80eb1d8c-11815865.pdf?src-supplier=RSComponents; ComponentLink2URL: https://datasheet.ciiva.com/41450/001181159-da-01-en-widerstand-era-0805-84r5-0-1-5000st-41450316.pdf?src-supplier=Conrad; ComponentLink2Description: https://datasheet.ciiva.com/41450/001181159-da-01-en-widerstand-era-0805-84r5-0-1-5000st-41450316.pdf?src-supplier=Conrad; ComponentLink3URL: https://datasheet.ciiva.com/6075/485442-6075305.pdf?src-supplier=Farnell; ComponentLink3Description: https://datasheet.ciiva.com/6075/485442-6075305.pdf?src-supplier=Farnell; ComponentLink4URL: https://datasheet.ciiva.com/9187/aoa0000ce26-9187305.pdf?src-supplier=Avnet; ComponentLink4Description: https://datasheet.ciiva.com/9187/aoa0000ce26-9187305.pdf?src-supplier=Avnet; ComponentLink5URL: https://datasheet.ciiva.com/6075/485442-6075306.pdf?src-supplier=Farnell; ComponentLink5Description: https://datasheet.ciiva.com/6075/485442-6075306.pdf?src-supplier=Farnell; ComponentLink6URL: https://datasheet.ciiva.com/6075/485442-6075307.pdf?src-supplier=Farnell; ComponentLink6Description: https://datasheet.ciiva.com/6075/485442-6075307.pdf?src-supplier=Farnell; Supplier Part Number 1: 667-ERA-6AEB84R5V
R13#2 R16#2 = ERA-6AED102V: Res Thin Film 0805 1K Ohm 0.5% 1/8W ±25ppm/°C Molded SMD SMD Punched Carrier T/R; Manufacturer 1: Panasonic; Category 1: Chip SMD Resistors; Resistance: 1kR; Power Rating: 125mW; Voltage Rating: 100V; Supplier 1: Mouser; Manufacturer Part Number 1: ERA-6AED102V; RoHS: Yes; Description 1: Res Thin Film 0805 1K Ohm 0.5% 1/8W ±25ppm/°C Molded SMD SMD Punched Carrier T/R; Stock 1: 18492; Mount: Surface Mount; Case/Package: 0805; Case Code (Imperial): 0805; Case Code (Metric): 2012; Contact Plating: Tin; Min Operating Temperature: -55°C; Max Operating Temperature: 155°C; Packaging: Tape and Reel; Tolerance: 0.5%; Package Quantity: 5000; Composition: Thin Film; Temperature Coefficient: 25ppm/°C; Military Standard: Not; Length: 2mm; Height: 0.5mm; Width: 1.25mm; Depth: 1.25mm; Lead Free: Lead Free; ComponentLink1URL: https://datasheet.ciiva.com/9198/aoa0000ce26-9198987.pdf?src-supplier=Avnet; ComponentLink1Description: https://datasheet.ciiva.com/9198/aoa0000ce26-9198987.pdf?src-supplier=Avnet; Supplier Part Number 1: 667-ERA-6AED102V
R15#2 R21#2 R22#2 R23#2 = ERJ-6GEY0R00V: RES SMD 0 OHM JUMPER 1/8W 0805; Manufacturer 1: Panasonic; Category 1: Chip SMD Resistors; Resistance: 0mR; Voltage Rating: 150V; Power Rating: 125mW; Tolerance: 5%; Temperature Coefficient: 600ppm/°C; Current Rating: 2A; Supplier 1: Mouser; Manufacturer Part Number 1: ERJ-6GEY0R00V; RoHS: Yes; Description 1: RES SMD 0 OHM JUMPER 1/8W 0805; Stock 1: 960895; Mount: Surface Mount; Case/Package: 0805; Contact Plating: Tin; Case Code (Imperial): 0805; Case Code (Metric): 2012; Min Operating Temperature: -55°C; Max Operating Temperature: 155°C; Composition: Thick Film; Packaging: Tape and Reel; Package Quantity: 1; Termination: SMD/SMT; Number of Terminations: 2; Military Standard: Not; Max Power Dissipation: 125mW; Voltage Rating (DC): 150V; Features: Automotive AEC-Q200; Length: 2mm; Height: 0.6mm; Width: 1.25mm; Depth: 1.25mm; Radiation Hardening: No; Lead Free: Lead Free; REACH SVHC: No SVHC; ComponentLink1URL: https://datasheet.ciiva.com/36526/1989607-36526237.pdf?src-supplier=Jameco; ComponentLink1Description: https://datasheet.ciiva.com/36526/1989607-36526237.pdf?src-supplier=Jameco; ComponentLink2URL: https://datasheet.ciiva.com/11821/0900766b80f806dd-11821735.pdf?src-supplier=RSComponents; ComponentLink2Description: https://datasheet.ciiva.com/11821/0900766b80f806dd-11821735.pdf?src-supplier=RSComponents; ComponentLink3URL: https://datasheet.ciiva.com/43460/1678796-43460073.pdf?src-supplier=Farnell; ComponentLink3Description: https://datasheet.ciiva.com/43460/1678796-43460073.pdf?src-supplier=Farnell; ComponentLink4URL: https://datasheet.ciiva.com/9117/aoa0000ce1-9117354.pdf?src-supplier=Avnet; ComponentLink4Description: https://datasheet.ciiva.com/9117/aoa0000ce1-9117354.pdf?src-supplier=Avnet; ComponentLink5URL: https://datasheet.ciiva.com/28695/1678796-28695877.pdf?src-supplier=Element14; ComponentLink5Description: https://datasheet.ciiva.com/28695/1678796-28695877.pdf?src-supplier=Element14; ComponentLink6URL: https://datasheet.ciiva.com/46377/1678796-46377866.pdf?src-supplier=Element14; ComponentLink6Description: https://datasheet.ciiva.com/46377/1678796-46377866.pdf?src-supplier=Element14; ComponentLink7URL: https://datasheet.ciiva.com/17215/aoa0000ce1-17215390.pdf?src-supplier=Avnet+Europe; ComponentLink7Description: https://datasheet.ciiva.com/17215/aoa0000ce1-17215390.pdf?src-supplier=Avnet+Europe; ComponentLink8URL: https://datasheet.ciiva.com/16512/aoa0000ce1-16512111.pdf?src-supplier=Avnet+Asia; ComponentLink8Description: https://datasheet.ciiva.com/16512/aoa0000ce1-16512111.pdf?src-supplier=Avnet+Asia; Supplier Part Number 1: 667-ERJ-6GEY0R00V
R19#2 R20#2 = ERJ-6ENF1003V: RES SMD 100K OHM 1% 1/8W 0805; Manufacturer 1: Panasonic; Category 1: Chip SMD Resistors; Resistance: 100kR; Temperature Coefficient: 100ppm/°C; Power Rating: 125mW; Voltage Rating: 150V; Supplier 1: Mouser; Manufacturer Part Number 1: ERJ-6ENF1003V; RoHS: Yes; Description 1: RES SMD 100K OHM 1% 1/8W 0805; Stock 1: 298428; Mount: Surface Mount; Case/Package: 0805; Number of Pins: 2; Contact Plating: Tin; Case Code (Metric): 2012; Case Code (Imperial): 0805; Min Operating Temperature: -55°C; Max Operating Temperature: 155°C; Tolerance: 1%; Composition: Thick Film; Packaging: Tape and Reel; Package Quantity: 1; Number of Terminations: 2; Military Standard: Not; Termination: SMD/SMT; Max Power Dissipation: 125mW; Voltage Rating (DC): 150V; Features: Automotive AEC-Q200; Length: 2mm; Height: 0.6mm; Width: 0.049inch; Depth: 1.25mm; Radiation Hardening: No; REACH SVHC: No SVHC; Lead Free: Lead Free; ComponentLink1URL: https://datasheet.ciiva.com/11821/0900766b80f80784-11821507.pdf?src-supplier=RSComponents; ComponentLink1Description: https://datasheet.ciiva.com/11821/0900766b80f80784-11821507.pdf?src-supplier=RSComponents; ComponentLink2URL: https://datasheet.ciiva.com/27055/1988989-27055734.pdf?src-supplier=Jameco; ComponentLink2Description: https://datasheet.ciiva.com/27055/1988989-27055734.pdf?src-supplier=Jameco; ComponentLink3URL: https://datasheet.ciiva.com/17208/aoa0000ce2-17208153.pdf?src-supplier=Avnet+Europe; ComponentLink3Description: https://datasheet.ciiva.com/17208/aoa0000ce2-17208153.pdf?src-supplier=Avnet+Europe; ComponentLink4URL: https://datasheet.ciiva.com/24023/aoa0000ce2-24023497.pdf?src-supplier=Mouser; ComponentLink4Description: https://datasheet.ciiva.com/24023/aoa0000ce2-24023497.pdf?src-supplier=Mouser; ComponentLink5URL: https://datasheet.ciiva.com/7830/426256-7830746.pdf?src-supplier=Element14; ComponentLink5Description: https://datasheet.ciiva.com/7830/426256-7830746.pdf?src-supplier=Element14; ComponentLink6URL: https://datasheet.ciiva.com/16788/70260748-16788734.pdf?src-supplier=Allied+Electronics; ComponentLink6Description: https://datasheet.ciiva.com/16788/70260748-16788734.pdf?src-supplier=Allied+Electronics; ComponentLink7URL: https://datasheet.ciiva.com/48531/aoa0000ce2-48531486.pdf?src-supplier=Avnet; ComponentLink7Description: https://datasheet.ciiva.com/48531/aoa0000ce2-48531486.pdf?src-supplier=Avnet; ComponentLink8URL: https://datasheet.ciiva.com/22723/426256-22723909.pdf?src-supplier=Element14; ComponentLink8Description: https://datasheet.ciiva.com/22723/426256-22723909.pdf?src-supplier=Element14; ComponentLink9URL: https://datasheet.ciiva.com/46419/1678782-46419877.pdf?src-supplier=Element14; ComponentLink9Description: https://datasheet.ciiva.com/46419/1678782-46419877.pdf?src-supplier=Element14; ComponentLink10URL: https://datasheet.ciiva.com/16449/aoa0000ce2-16449480.pdf?src-supplier=Future+Electronics; ComponentLink10Description: https://datasheet.ciiva.com/16449/aoa0000ce2-16449480.pdf?src-supplier=Future+Electronics; ComponentLink11URL: https://datasheet.ciiva.com/22667/1678782-22667897.pdf?src-supplier=Element14; ComponentLink11Description: https://datasheet.ciiva.com/22667/1678782-22667897.pdf?src-supplier=Element14; ComponentLink12URL: https://datasheet.ciiva.com/30257/aoa0000ce2-30257690.pdf?src-supplier=Onlinecomponents.com; ComponentLink12Description: https://datasheet.ciiva.com/30257/aoa0000ce2-30257690.pdf?src-supplier=Onlinecomponents.com; ComponentLink13URL: https://datasheet.ciiva.com/7830/426256-7830988.pdf?src-supplier=Element14; ComponentLink13Description: https://datasheet.ciiva.com/7830/426256-7830988.pdf?src-supplier=Element14; ComponentLink14URL: https://datasheet.ciiva.com/16776/70260748-16776892.pdf?src-supplier=Allied+Electronics; ComponentLink14Description: https://datasheet.ciiva.com/16776/70260748-16776892.pdf?src-supplier=Allied+Electronics; Supplier Part Number 1: 667-ERJ-6ENF1003V
U1#2 = VCNL4010-GS08: SENS IR PROXIMITY AMB LT 12LLP; Manufacturer 1: Vishay Semiconductors; Category 1: Sensors; Operating Supply Voltage: 3.3V; Number of Channels: 1; Wavelength: 892nm; Min Supply Voltage: 2.5V; Max Supply Voltage: 3.6V; Sensing Distance: 200mm; Power Dissipation: 50mW; Output Type: I2C,Digital; Sensing Method: Optical; Output Configuration: Digital; Supplier 1: Mouser; Manufacturer Part Number 1: VCNL4010-GS08; RoHS: Yes; Description 1: SENS IR PROXIMITY AMB LT 12LLP; Stock 1: 15561; Mount: Surface Mount; Case/Package: SMD/SMT; Number of Pins: 13; Min Operating Temperature: -25°C; Max Operating Temperature: 85°C; Packaging: Tape and Reel; Package Quantity: 1800; Length: 3.95mm; Height: 0.75mm; Width: 3.95mm; Radiation Hardening: No; REACH SVHC: Unknown; Lead Free: Lead Free; ComponentLink1URL: https://datasheet.ciiva.com/4626/vcnl4010-97030-4626352.pdf?src-supplier=Mouser; ComponentLink1Description: https://datasheet.ciiva.com/4626/vcnl4010-97030-4626352.pdf?src-supplier=Mouser; ComponentLink2URL: https://datasheet.ciiva.com/7617/vcnl4010-7617985.pdf?src-supplier=Element14; ComponentLink2Description: https://datasheet.ciiva.com/7617/vcnl4010-7617985.pdf?src-supplier=Element14; ComponentLink3URL: https://datasheet.ciiva.com/15230/vcnl4010-15230062.pdf?src-supplier=Arrow+Europe; ComponentLink3Description: https://datasheet.ciiva.com/15230/vcnl4010-15230062.pdf?src-supplier=Arrow+Europe; ComponentLink4URL: https://datasheet.ciiva.com/16225/vcnl4010-16225925.pdf?src-supplier=Future+Electronics; ComponentLink4Description: https://datasheet.ciiva.com/16225/vcnl4010-16225925.pdf?src-supplier=Future+Electronics; ComponentLink5URL: https://datasheet.ciiva.com/14650/vcnl4010-14650582.pdf?src-supplier=Element14; ComponentLink5Description: https://datasheet.ciiva.com/14650/vcnl4010-14650582.pdf?src-supplier=Element14; ComponentLink6URL: https://datasheet.ciiva.com/2819/vcnl4010-2819260.pdf?src-supplier=Digi-Key; ComponentLink6Description: https://datasheet.ciiva.com/2819/vcnl4010-2819260.pdf?src-supplier=Digi-Key; ComponentLink7URL: https://datasheet.ciiva.com/2819/vcnl4010-2819261.pdf?src-supplier=Digi-Key; ComponentLink7Description: https://datasheet.ciiva.com/2819/vcnl4010-2819261.pdf?src-supplier=Digi-Key; ComponentLink8URL: https://datasheet.ciiva.com/25912/vcnl4010-25912077.pdf?src-supplier=Avnet+Europe; ComponentLink8Description: https://datasheet.ciiva.com/25912/vcnl4010-25912077.pdf?src-supplier=Avnet+Europe; ComponentLink9URL: https://datasheet.ciiva.com/2819/vcnl4010-2819262.pdf?src-supplier=Digi-Key; ComponentLink9Description: https://datasheet.ciiva.com/2819/vcnl4010-2819262.pdf?src-supplier=Digi-Key; ComponentLink10URL: https://datasheet.ciiva.com/3275/vcnl4010-3275278.pdf?src-supplier=Avnet; ComponentLink10Description: https://datasheet.ciiva.com/3275/vcnl4010-3275278.pdf?src-supplier=Avnet; Supplier Part Number 1: 78-VCNL4010-GS08
U2#2 = BME280: Pressure, Temperature and Humidity Sensor Digital Output 1.8V 8-Pin LGA T/R; Manufacturer 1: Bosch; Category 1: Pressure Sensors; Manufacturer Part Number 1: BME280; RoHS: No; Description 1: Pressure, Temperature and Humidity Sensor Digital Output 1.8V 8-Pin LGA T/R; Stock 1: 22089; Case/Package: LGA; Number of Pins: 8; Lead Free: Lead Free; ComponentLink1URL: https://ae-bst.resource.bosch.com/media/_tech/media/product_flyer/BME280_Productflyer_BST_20170109.pdf?src-supplier=Future+Electronics; ComponentLink1Description: https://ae-bst.resource.bosch.com/media/_tech/media/product_flyer/BME280_Productflyer_BST_20170109.pdf?src-supplier=Future+Electronics; ComponentLink2URL: https://ae-bst.resource.bosch.com/media/_tech/media/datasheets/BST-BME280-DS002.pdf?src-supplier=Digi-Key; ComponentLink2Description: https://ae-bst.resource.bosch.com/media/_tech/media/datasheets/BST-BME280-DS002.pdf?src-supplier=Digi-Key; ComponentLink3URL: https://ae-bst.resource.bosch.com/media/_tech/media/product_flyer/BME280_Productflyer_BST_20170109.pdf?src-supplier=Arrow; ComponentLink3Description: https://ae-bst.resource.bosch.com/media/_tech/media/product_flyer/BME280_Productflyer_BST_20170109.pdf?src-supplier=Arrow; ComponentLink4URL: https://ae-bst.resource.bosch.com/media/_tech/media/product_flyer/BME280_Productflyer_BST_20170109.pdf?src-supplier=Mouser; ComponentLink4Description: https://ae-bst.resource.bosch.com/media/_tech/media/product_flyer/BME280_Productflyer_BST_20170109.pdf?src-supplier=Mouser; ComponentLink5URL: https://ae-bst.resource.bosch.com/media/_tech/media/product_flyer/BME280_Productflyer_BST_20170109.pdf?src-supplier=Rutronik; ComponentLink5Description: https://ae-bst.resource.bosch.com/media/_tech/media/product_flyer/BME280_Productflyer_BST_20170109.pdf?src-supplier=Rutronik; ComponentLink6URL: https://ae-bst.resource.bosch.com/media/_tech/media/product_flyer/BME280_Productflyer_BST_20170109.pdf?src-supplier=NAC+Semi; ComponentLink6Description: https://ae-bst.resource.bosch.com/media/_tech/media/product_flyer/BME280_Productflyer_BST_20170109.pdf?src-supplier=NAC+Semi; Supplier 1: Mouser; Supplier Part Number 1: 262-BME280
U3#2 = MICS-6814: SHUT HEIGHT GAGE(119.5MM); Manufacturer 1: SGX Sensortech; Supplier 1: Farnell; Manufacturer Part Number 1: MICS-6814; RoHS: No; Description 1: SHUT HEIGHT GAGE(119.5MM); Pricing 1: 1=15.34000, 5=14.06000, 10=12.78000, 25=11.83000 (GBP); Supplier Part Number 1: 2925869
U4#2 = ADS1115IDGSR: IC ADC 16BIT 860SPS LP 10MSOP; Manufacturer 1: Texas Instruments; Category 1: Analog to Digital Converters (ADCs); Interface: I2C; Number of Bits: 16; Sampling Rate: 860S/s; Number of A/D Converters: 1; Resolution: 16b; Polarity: Bipolar; Min Supply Voltage: 2V; Max Supply Voltage: 5.5V; Supply Type: Single; Conversion Rate: 0.86KS/s; Number of Inputs: 4; Integral Nonlinearity (INL): 1LSB; Power Dissipation: 900uW; Supplier 1: Mouser; Manufacturer Part Number 1: ADS1115IDGSR; RoHS: Yes; Description 1: IC ADC 16BIT 860SPS LP 10MSOP; Stock 1: 14706; Case/Package: VSSOP; Number of Pins: 10; Contact Plating: Gold; Min Operating Temperature: -40°C; Max Operating Temperature: 125°C; Package Quantity: 2500; Packaging: Tape and Reel; Number of Converters: 1; Max Supply Voltage (DC): 5.5V; Min Supply Voltage (DC): 2V; Radiation Hardening: No; REACH SVHC: No SVHC; Lead Free: Lead Free; ComponentLink1URL: https://datasheet.ciiva.com/4031/47725463s8438921n7713-4031028.pdf?src-supplier=Arrow; ComponentLink1Description: https://datasheet.ciiva.com/4031/47725463s8438921n7713-4031028.pdf?src-supplier=Arrow; ComponentLink2URL: https://datasheet.ciiva.com/25993/sbas444b-25993205.pdf?src-supplier=Avnet+Europe; ComponentLink2Description: https://datasheet.ciiva.com/25993/sbas444b-25993205.pdf?src-supplier=Avnet+Europe; ComponentLink3URL: https://datasheet.ciiva.com/1304/ads1113-1304266.pdf?src-supplier=Digi-Key; ComponentLink3Description: https://datasheet.ciiva.com/1304/ads1113-1304266.pdf?src-supplier=Digi-Key; Supplier Part Number 1: 595-ADS1115IDGSR
U5 = MAX98357AETE+T: IC AUDIO AMP CLASS D 16-TQFN; Manufacturer 1: Maxim; Category 1: Amplifiers - Audio; Voltage Gain: 15dB; Min Supply Voltage: 2.5V; Max Supply Voltage: 5.5V; Max Output Power: 3.2W; Power Supply Rejection Ratio (PSRR): 77dB; Max Power Dissipation: 1.666W; Max Output Current: 1.6A; Supplier 1: Mouser; Manufacturer Part Number 1: MAX98357AETE+T; RoHS: Yes; Description 1: IC AUDIO AMP CLASS D 16-TQFN; Stock 1: 6162; Mount: Surface Mount; Number of Pins: 16; Contact Plating: Tin,Matte; Min Operating Temperature: -40°C; Max Operating Temperature: 85°C; Packaging: Tape and Reel; Radiation Hardening: No; ComponentLink1URL: https://datasheet.ciiva.com/29970/max98357a-max98357b-29970280.pdf?src-supplier=Avnet; ComponentLink1Description: https://datasheet.ciiva.com/29970/max98357a-max98357b-29970280.pdf?src-supplier=Avnet; Supplier Part Number 1: 700-MAX98357AETE+T
U6#2 = LM358DR: IC OPAMP GP 700KHZ 8SOIC; Manufacturer 1: Texas Instruments; Category 1: Amplifiers - Op Amps, Buffer, Instrumentation; Number of Circuits: 2; Max Supply Voltage: 32V; Min Supply Voltage: 3V; Nominal Supply Current: 1.2mA; Common Mode Rejection Ratio: 65dB; Min Dual Supply Voltage: 1.5V; Max Dual Supply Voltage: 16V; Voltage Gain: 100dB; Slew Rate: 0.3V/µs; Output Current: 30mA; Input Bias Current: 250nA; Input Offset Voltage (Vos): 7mV; Operating Supply Current: 1mA; Dual Supply Voltage: 9V; Supplier 1: Mouser; Manufacturer Part Number 1: LM358DR; RoHS: Yes; Description 1: IC OPAMP GP 700KHZ 8SOIC; Stock 1: 15836; Mount: Surface Mount; Case/Package: SOIC; Number of Pins: 8; Contact Plating: Gold; Min Operating Temperature: 0°C; Max Operating Temperature: 70°C; Packaging: Tape and Reel; Number of Channels: 2; Gain Bandwidth Product: 700kHz; Package Quantity: 2500; Operating Supply Voltage: 16V; Bandwidth: 700kHz; Output Current per Channel: 30mA; Number of Elements: 2; Unity Gain Bandwidth Product: 700kHz; Number of Amplifiers: 2; Power Supply Rejection Ratio (PSRR): 65dB; Length: 4.9mm; Height: 1.58mm; Width: 3.91mm; Radiation Hardening: No; Lead Free: Lead Free; REACH SVHC: No SVHC; ComponentLink1URL: https://datasheet.ciiva.com/1795/lm358-1795488.pdf?src-supplier=Digi-Key; ComponentLink1Description: https://datasheet.ciiva.com/1795/lm358-1795488.pdf?src-supplier=Digi-Key; ComponentLink2URL: https://datasheet.ciiva.com/27056/2016330-27056228.pdf?src-supplier=Jameco; ComponentLink2Description: https://datasheet.ciiva.com/27056/2016330-27056228.pdf?src-supplier=Jameco; ComponentLink3URL: https://datasheet.ciiva.com/26847/lm358dr-26847142.pdf?src-supplier=IIIC; ComponentLink3Description: https://datasheet.ciiva.com/26847/lm358dr-26847142.pdf?src-supplier=IIIC; ComponentLink4URL: https://datasheet.ciiva.com/2973/lm358a-2973386.pdf?src-supplier=Avnet; ComponentLink4Description: https://datasheet.ciiva.com/2973/lm358a-2973386.pdf?src-supplier=Avnet; ComponentLink5URL: https://datasheet.ciiva.com/46390/1874566-46390414.pdf?src-supplier=Element14; ComponentLink5Description: https://datasheet.ciiva.com/46390/1874566-46390414.pdf?src-supplier=Element14; ComponentLink6URL: https://datasheet.ciiva.com/7709/1874566-7709823.pdf?src-supplier=Element14; ComponentLink6Description: https://datasheet.ciiva.com/7709/1874566-7709823.pdf?src-supplier=Element14; ComponentLink7URL: https://datasheet.ciiva.com/1795/lm358-1795489.pdf?src-supplier=Digi-Key; ComponentLink7Description: https://datasheet.ciiva.com/1795/lm358-1795489.pdf?src-supplier=Digi-Key; ComponentLink8URL: https://datasheet.ciiva.com/46385/1874566-46385851.pdf?src-supplier=Element14; ComponentLink8Description: https://datasheet.ciiva.com/46385/1874566-46385851.pdf?src-supplier=Element14; ComponentLink9URL: https://datasheet.ciiva.com/1795/lm358-1795487.pdf?src-supplier=Digi-Key; ComponentLink9Description: https://datasheet.ciiva.com/1795/lm358-1795487.pdf?src-supplier=Digi-Key; Supplier Part Number 1: 595-LM358DR

## Nets that join several sheets
+3V3: [2] - Header and I2C (HDR?.1 HDR?.17 R1#1.2 R2#1.2), [3] - Gas Sensor and ADC (6 pins), [4] - Proximity,Temperature Sensors and OLED (14 pins), [5] - Microphone, Sound and LEDs (8 pins), [6] - A2 Full Schematic (32 pins)
+5V: [2] - Header and I2C (HDR?.2 HDR?.4), [6] - A2 Full Schematic (HDR1.2 HDR1.4)
GND: [2] - Header and I2C (7 pins), [3] - Gas Sensor and ADC (7 pins), [4] - Proximity,Temperature Sensors and OLED (11 pins), [5] - Microphone, Sound and LEDs (16 pins), [6] - A2 Full Schematic (41 pins)
AI0: [3] - Gas Sensor and ADC (U4#1.4), [5] - Microphone, Sound and LEDs (C12#1.2), [6] - A2 Full Schematic (C12#2.2 U4#2.4)
ALERT: [2] - Header and I2C (HDR?.29), [3] - Gas Sensor and ADC (R6#1.1 U4#1.2), [6] - A2 Full Schematic (HDR1.29 R6#2.1 U4#2.2)
BCLK: [2] - Header and I2C (HDR?.18), [5] - Microphone, Sound and LEDs (U?.16), [6] - A2 Full Schematic (HDR1.18 U5.16)
BLUE: [2] - Header and I2C (HDR?.12), [5] - Microphone, Sound and LEDs (R23#1.2), [6] - A2 Full Schematic (HDR1.12 R23#2.2)
CO: [3] - Gas Sensor and ADC (R7#1.1 U3#1.8 U4#1.7), [6] - A2 Full Schematic (R7#2.1 U3#2.8 U4#2.7)
DIN: [2] - Header and I2C (HDR?.21), [5] - Microphone, Sound and LEDs (U?.1), [6] - A2 Full Schematic (HDR1.21 U5.1)
GREEN: [2] - Header and I2C (HDR?.10), [5] - Microphone, Sound and LEDs (R22#1.2), [6] - A2 Full Schematic (HDR1.10 R22#2.2)
I2C_SCL: [2] - Header and I2C (HDR?.5 R2#1.1), [3] - Gas Sensor and ADC (U4#1.10), [4] - Proximity,Temperature Sensors and OLED (OLED#1.3 U1#1.5 U2#1.4), [6] - A2 Full Schematic (6 pins)
I2C_SDA: [2] - Header and I2C (D1#1.2 HDR?.3 R1#1.1), [3] - Gas Sensor and ADC (U4#1.9), [4] - Proximity,Temperature Sensors and OLED (OLED#1.4 U1#1.4 U2#1.3), [6] - A2 Full Schematic (7 pins)
LRCLK: [2] - Header and I2C (HDR?.19), [5] - Microphone, Sound and LEDs (U?.14), [6] - A2 Full Schematic (HDR1.19 U5.14)
NH3: [3] - Gas Sensor and ADC (R9#1.1 U3#1.4 U4#1.5), [6] - A2 Full Schematic (R9#2.1 U3#2.4 U4#2.5)
NO2: [3] - Gas Sensor and ADC (R8#1.1 U3#1.1 U4#1.6), [6] - A2 Full Schematic (R8#2.1 U3#2.1 U4#2.6)
OUT+: [5] - Microphone, Sound and LEDs (C15#1.2 JP1#1.1 U?.9), [6] - A2 Full Schematic (C15#2.2 JP1#2.1 U5.9)
OUT-: [5] - Microphone, Sound and LEDs (C14#1.2 JP1#1.2 U?.10), [6] - A2 Full Schematic (C14#2.2 JP1#2.2 U5.10)
RED: [2] - Header and I2C (HDR?.8), [5] - Microphone, Sound and LEDs (R21#1.2), [6] - A2 Full Schematic (HDR1.8 R21#2.2)
VCNL_INT: [2] - Header and I2C (HDR?.26), [4] - Proximity,Temperature Sensors and OLED (R4#1.1 U1#1.6), [6] - A2 Full Schematic (HDR1.26 R4#2.1 U1#2.6)